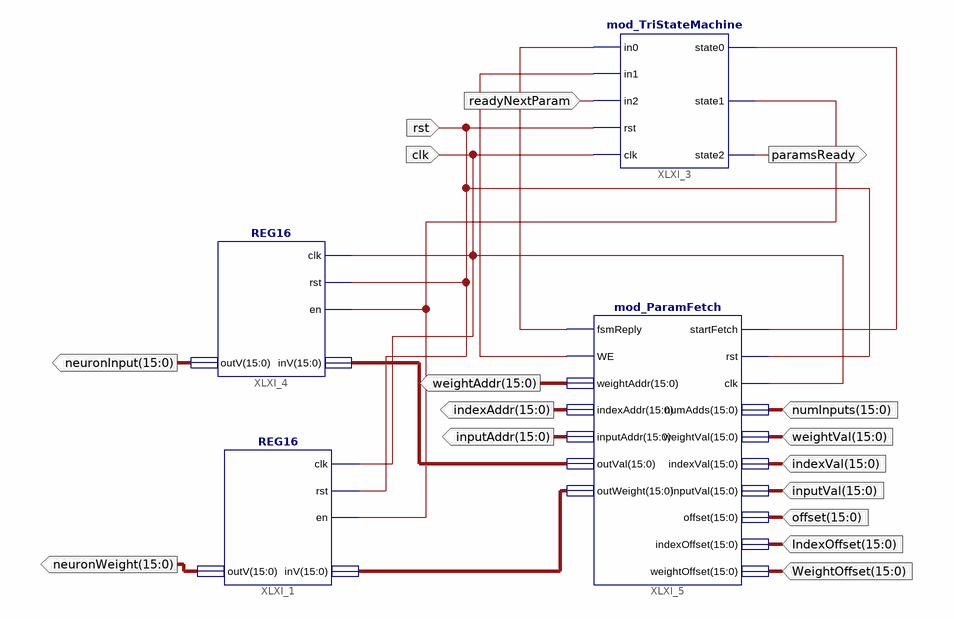
[diagram p0: schematic sheet 1]
// Xilinx ISE schematic mod_ParamFetchStage.sch (spartan3e) as structural Verilog: 4 symbols, 16 ports
module mod_ParamFetchStage (
  input  clk,
  input  rst,
  input  readyNextParam,
  input  [15:0] numInputs,
  input  [15:0] weightVal,
  input  [15:0] indexVal,
  input  [15:0] inputVal,
  input  [15:0] offset,
  input  [15:0] IndexOffset,
  input  [15:0] WeightOffset,
  output [15:0] neuronInput,
  output [15:0] neuronWeight,
  output [15:0] weightAddr,
  output [15:0] indexAddr,
  output [15:0] inputAddr,
  output paramsReady
);

  wire XLXN_1, XLXN_2, XLXN_9, XLXN_11;
  wire [15:0] XLXN_5, XLXN_6;

  REG16 XLXI_1 (.clk(clk), .rst(rst), .en(XLXN_2), .inV(XLXN_6), .outV(neuronWeight));
  mod_TriStateMachine XLXI_3 (
    .in0(XLXN_11), .in1(XLXN_9), .in2(readyNextParam), .rst(rst), .clk(clk), .state0(XLXN_1),
    .state1(XLXN_2), .state2(paramsReady));
  REG16 XLXI_4 (.clk(clk), .rst(rst), .en(XLXN_2), .inV(XLXN_5), .outV(neuronInput));
  mod_ParamFetch XLXI_5 (
    .startFetch(XLXN_1), .rst(rst), .clk(clk), .numAdds(numInputs), .offset(offset), .weightVal(weightVal),
    .indexVal(indexVal), .inputVal(inputVal), .fsmReply(XLXN_11), .WE(XLXN_9), .weightAddr(weightAddr),
    .indexAddr(indexAddr), .inputAddr(inputAddr), .outVal(XLXN_5), .outWeight(XLXN_6),
    .indexOffset(IndexOffset), .weightOffset(WeightOffset));
endmodule
